# Altium schematic sheet Input_Section.SchDoc: Input_Section
size A2; Date: 2026-04-25; ApprovedBy: Anbi; CheckedBy: Anbi; Author: FunnyElecs; CompanyName: DongA; DrawnBy: Seokipo; Engineer: Seokipo; Revision: 1.0; SheetNumber: 3; SheetTotal: 6
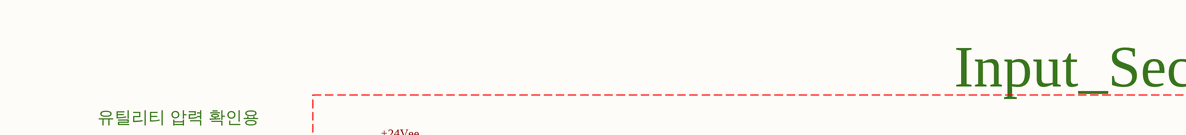
[diagram p0: Input_Section.SchDoc, top left]
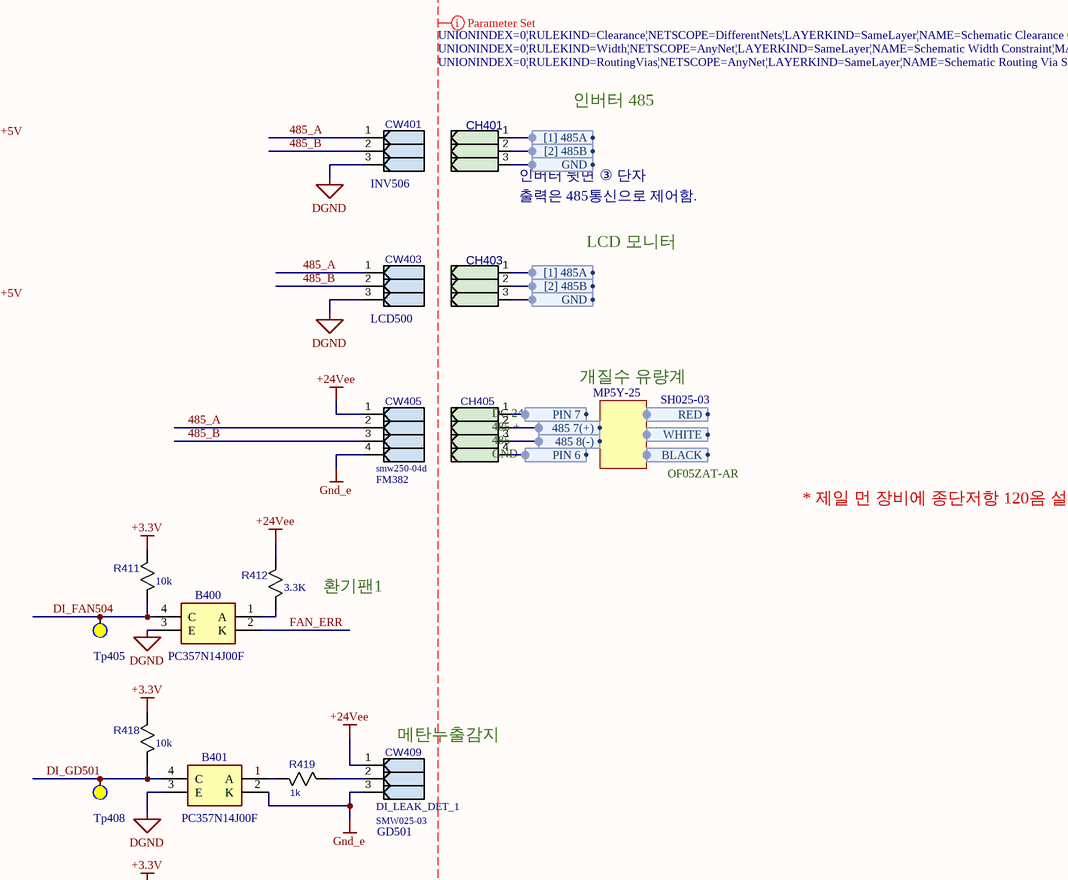
[diagram p1: Input_Section.SchDoc, top right]
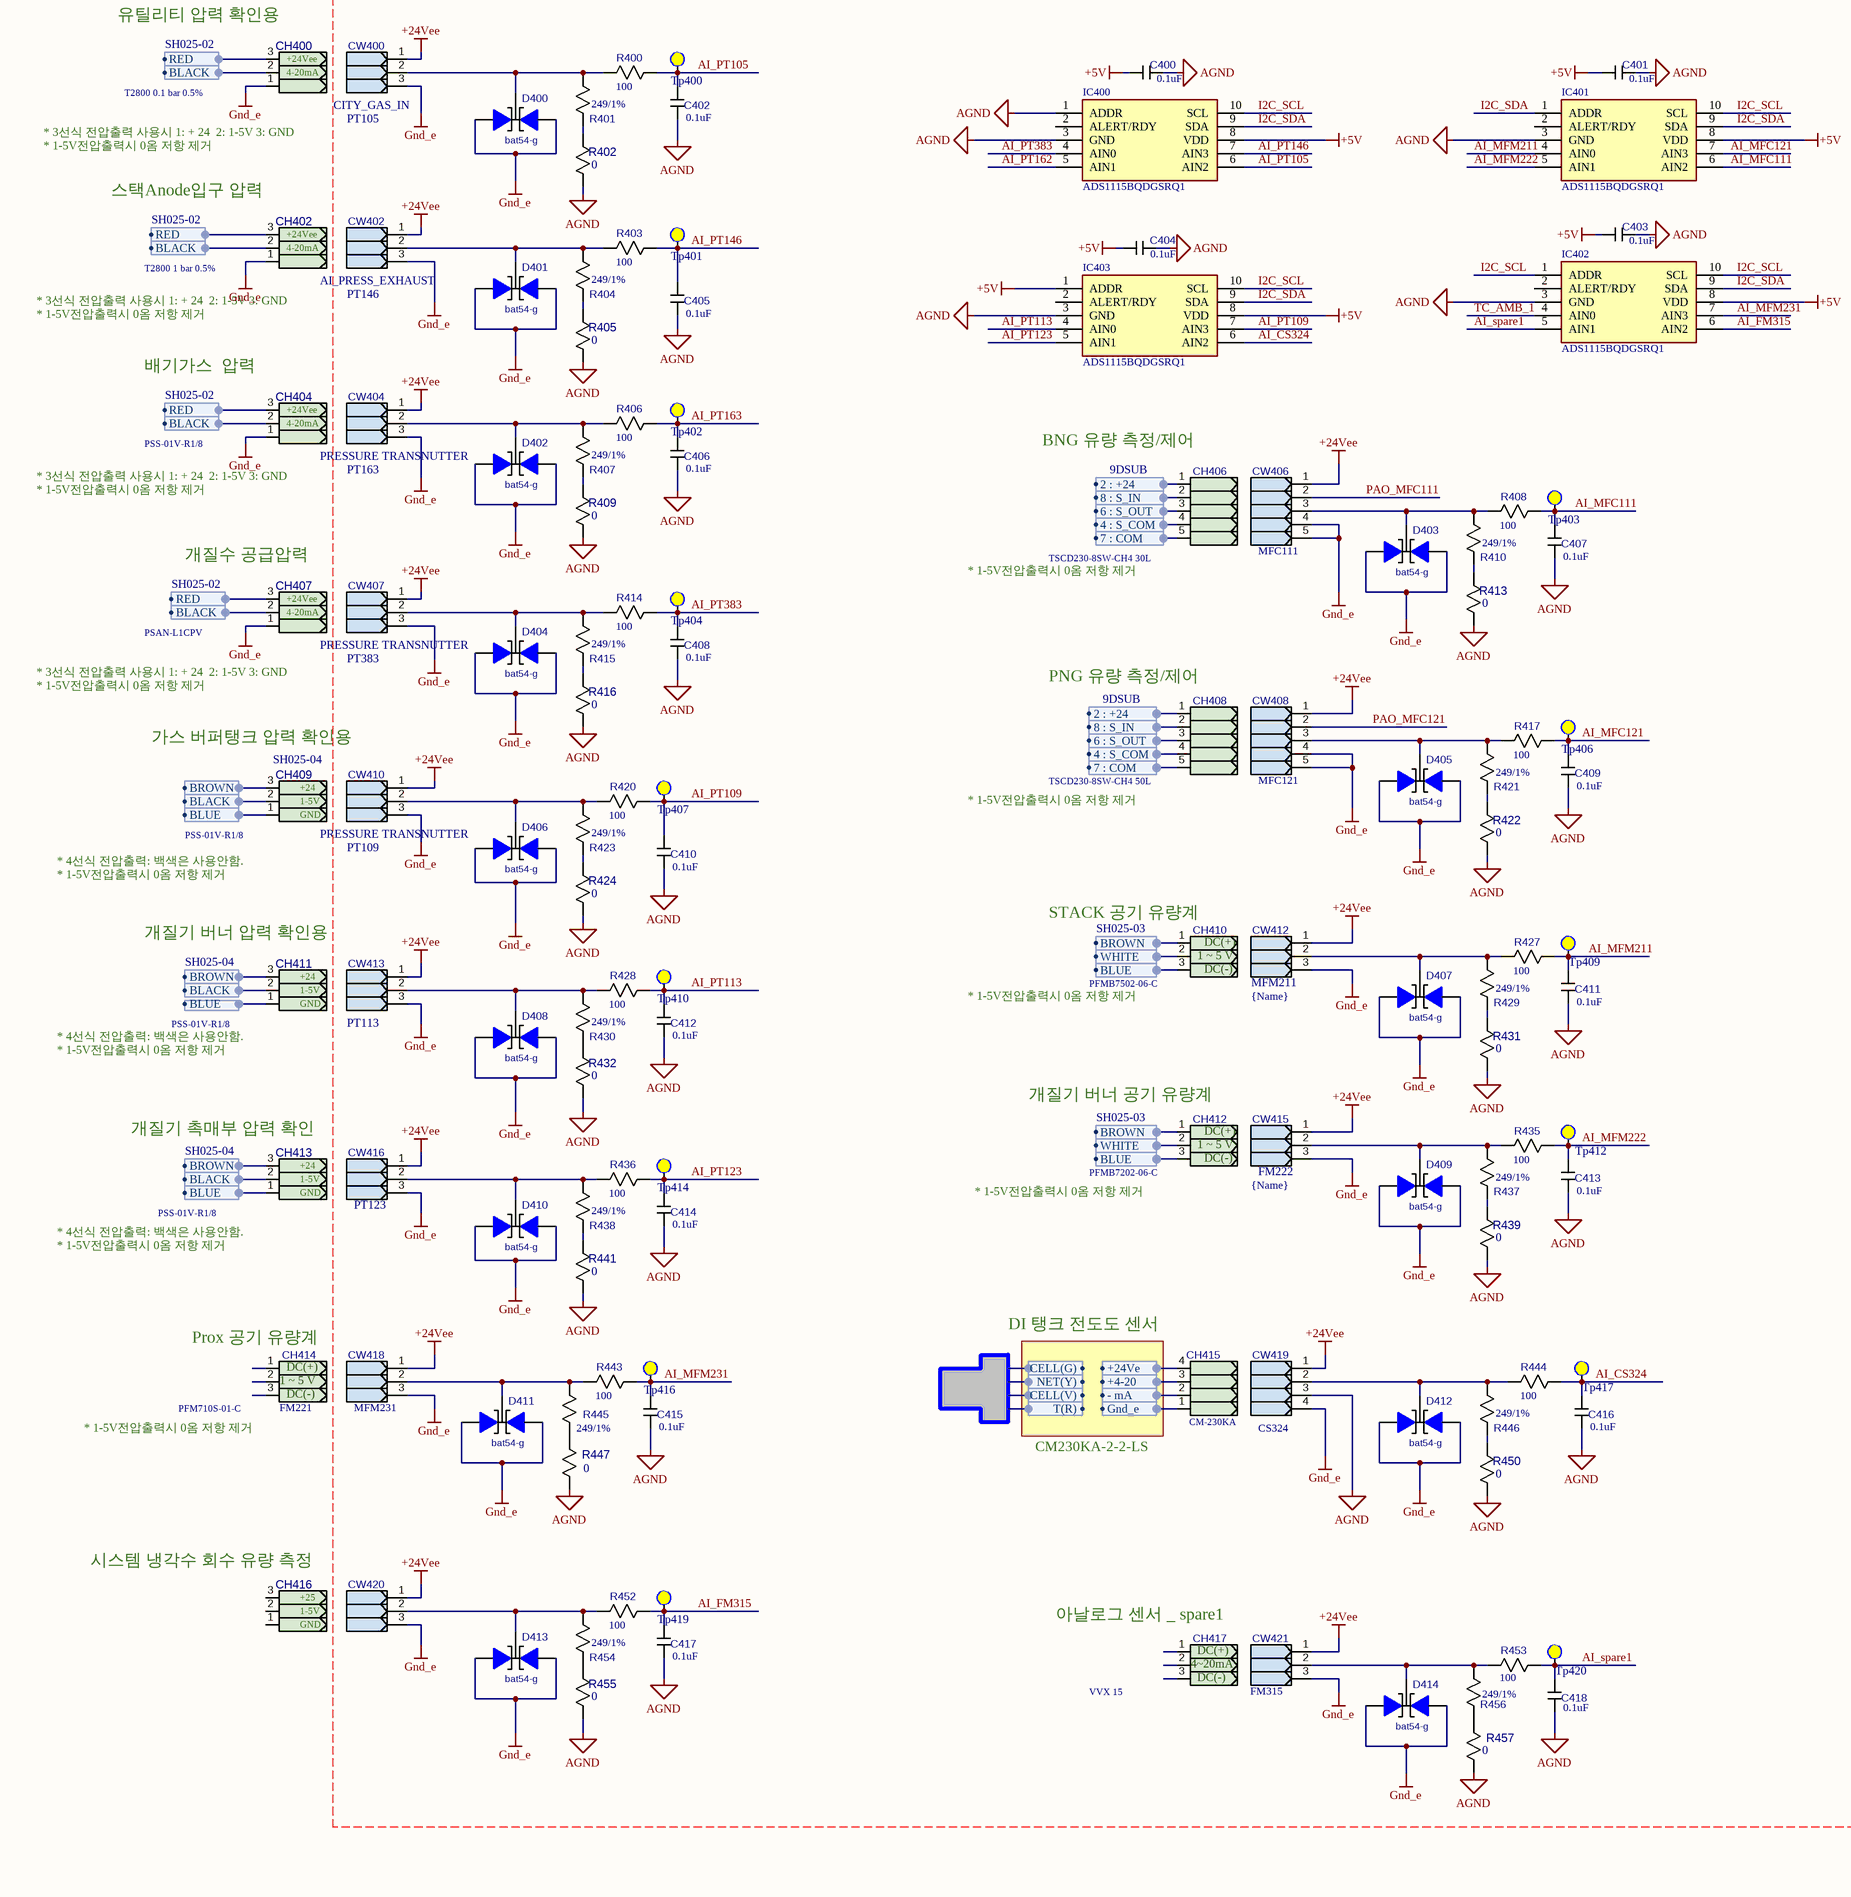
[diagram p2: Input_Section.SchDoc, bottom left]
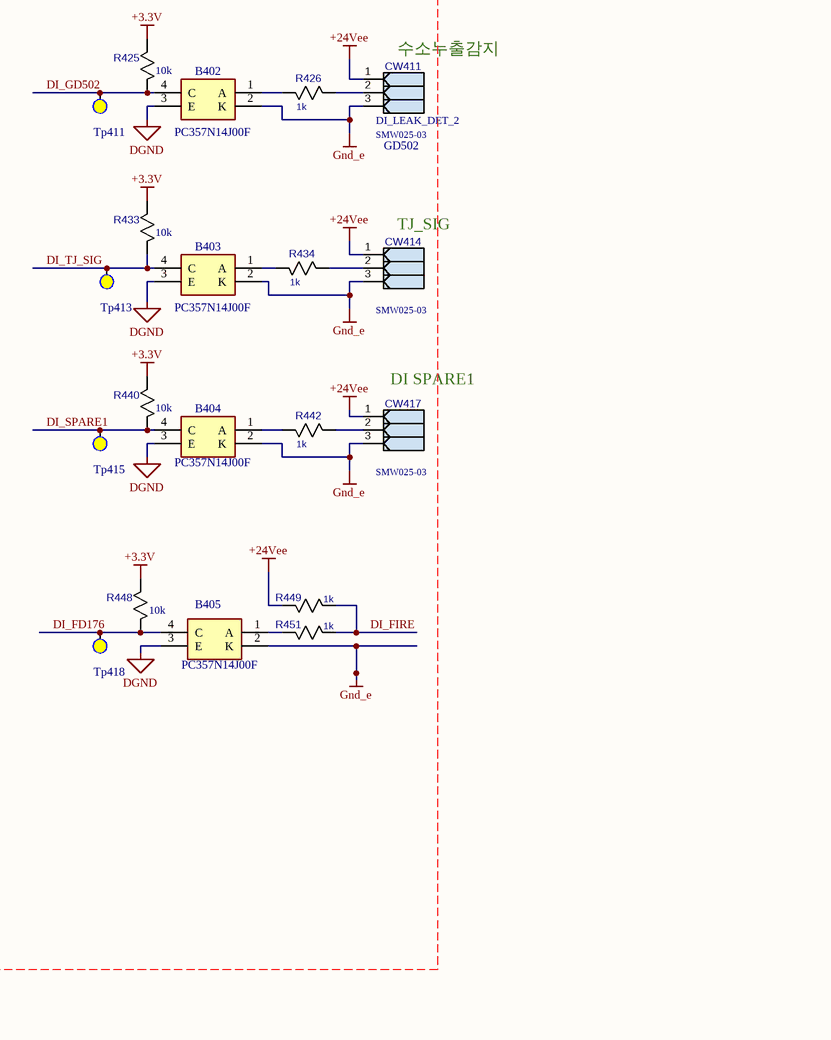
[diagram p3: Input_Section.SchDoc, bottom right]

## Parts
B400  PC357N14J00F  [SOP254P675X300-4N]
B401  PC357N14J00F  [SOP254P675X300-4N]
B402  PC357N14J00F  [SOP254P675X300-4N]
B403  PC357N14J00F  [SOP254P675X300-4N]
B404  PC357N14J00F  [SOP254P675X300-4N]
B405  PC357N14J00F  [SOP254P675X300-4N]
C400  규격: 0.1uF  [CC1608N]  (hidden comment: CS1608)
C401  규격: 0.1uF  [CC1608N]  (hidden comment: CS1608)
C402  규격: 0.1uF  [CC1608N]  (hidden comment: CS1608)
C403  규격: 0.1uF  [CC1608N]  (hidden comment: CS1608)
C404  규격: 0.1uF  [CC1608N]  (hidden comment: CS1608)
C405  규격: 0.1uF  [CC1608N]  (hidden comment: CS1608)
C406  규격: 0.1uF  [CC1608N]  (hidden comment: CS1608)
C407  규격: 0.1uF  [CC1608N]  (hidden comment: CS1608)
C408  규격: 0.1uF  [CC1608N]  (hidden comment: CS1608)
C409  규격: 0.1uF  [CC1608N]  (hidden comment: CS1608)
C410  규격: 0.1uF  [CC1608N]  (hidden comment: CS1608)
C411  규격: 0.1uF  [CC1608N]  (hidden comment: CS1608)
C412  규격: 0.1uF  [CC1608N]  (hidden comment: CS1608)
C413  규격: 0.1uF  [CC1608N]  (hidden comment: CS1608)
C414  규격: 0.1uF  [CC1608N]  (hidden comment: CS1608)
C415  규격: 0.1uF  [CC1608N]  (hidden comment: CS1608)
C416  규격: 0.1uF  [CC1608N]  (hidden comment: CS1608)
C417  규격: 0.1uF  [CC1608N]  (hidden comment: CS1608)
C418  규격: 0.1uF  [CC1608N]  (hidden comment: CS1608)
CH400  Part No.: T2800 0.1 bar 0.5%  (hidden comment: Connect Housing)
CH401  Connect Housing  (value not drawn)
CH402  Part No.: T2800 1 bar 0.5%  (hidden comment: Connect Housing)
CH403  Connect Housing  (value not drawn)
CH404  Part No.: PSS-01V-R1/8  (hidden comment: Connect Housing)
CH405  Connect Housing  (value not drawn)
CH406  Part No.: TSCD230-8SW-CH4 30L  (hidden comment: Connect Housing)
CH407  Part No.: PSAN-L1CPV  (hidden comment: Connect Housing)
CH408  Part No.: TSCD230-8SW-CH4 50L  (hidden comment: Connect Housing)
CH409  Part No.: PSS-01V-R1/8  (hidden comment: Connect Housing)
CH410  Part No.: PFMB7502-06-C  (hidden comment: Connect Housing)
CH411  Part No.: PSS-01V-R1/8  (hidden comment: Connect Housing)
CH412  Part No.: PFMB7202-06-C  (hidden comment: Connect Housing)
CH413  Part No.: PSS-01V-R1/8  (hidden comment: Connect Housing)
CH414  Part No.: PFM710S-01-C  BOP No: FM221  (hidden comment: Connect Housing)
CH415  Part No.: CM-230KA  (hidden comment: Connect Housing)
CH416  Connect Housing  (value not drawn)
CH417  Part No.: VVX 15  (hidden comment: Connect Housing)
CW400  Name: CITY_GAS_IN  BOP No: PT105  [SMW250-03D]  (hidden comment: SMW250-03D)
CW401  BOP No: INV506  [SMW250-03D]  (hidden comment: SMW250-03D)
CW402  Name: AI_PRESS_EXHAUST  BOP No: PT146  [SMW250-03D]  (hidden comment: SMW250-03D)
CW403  BOP No: LCD500  [SMW250-03D]  (hidden comment: SMW250-03D)
CW404  Name: PRESSURE TRANSNUTTER  BOP No: PT163  [SMW250-03D]  (hidden comment: SMW250-03D)
CW405  BOP No: FM382  [SMW250-04D]  (hidden comment: SMW250-04D)
CW406  BOP No: MFC111  [SMW250-05D]  (hidden comment: SMW250-05D)
CW407  Name: PRESSURE TRANSNUTTER  BOP No: PT383  [SMW250-03D]  (hidden comment: SMW250-03D)
CW408  BOP No: MFC121  [SMW250-05D]  (hidden comment: SMW250-05D)
CW409  Name: DI_LEAK_DET_1  Part No.: SMW025-03  BOP No: GD501  [SMW250-03D]  (hidden comment: SMW250-03D)
CW410  Name: PRESSURE TRANSNUTTER  BOP No: PT109  [SMW250-03D]  (hidden comment: SMW250-03D)
CW411  Name: DI_LEAK_DET_2  Part No.: SMW025-03  BOP No: GD502  [SMW250-03D]  (hidden comment: SMW250-03D)
CW412  Name: {Name}  BOP No: MFM211  [SMW250-03D]  (hidden comment: SMW250-03D)
CW413  BOP No: PT113  [SMW250-03D]  (hidden comment: SMW250-03D)
CW414  Part No.: SMW025-03  [SMW250-03D]  (hidden comment: SMW250-03D)
CW415  Name: {Name}  BOP No: FM222  [SMW250-03D]  (hidden comment: SMW250-03D)
CW416  BOP No: PT123  [SMW250-03D]  (hidden comment: SMW250-03D)
CW417  Part No.: SMW025-03  [SMW250-03D]  (hidden comment: SMW250-03D)
CW418  BOP No: MFM231  [SMW250-03D]  (hidden comment: SMW250-03D)
CW419  BOP No: CS324  [SMW250-04D]  (hidden comment: SMW250-04D)
CW420  SMW250-03D  [SMW250-03D]  (value not drawn)
CW421  BOP No: FM315  [SMW250-03D]  (hidden comment: SMW250-03D)
D400  Part No.: bat54-g  [SOT-23]  (hidden comment: BAT54C-G)
D401  Part No.: bat54-g  [SOT-23]  (hidden comment: BAT54C-G)
D402  Part No.: bat54-g  [SOT-23]  (hidden comment: BAT54C-G)
D403  Part No.: bat54-g  [SOT-23]  (hidden comment: BAT54C-G)
D404  Part No.: bat54-g  [SOT-23]  (hidden comment: BAT54C-G)
D405  Part No.: bat54-g  [SOT-23]  (hidden comment: BAT54C-G)
D406  Part No.: bat54-g  [SOT-23]  (hidden comment: BAT54C-G)
D407  Part No.: bat54-g  [SOT-23]  (hidden comment: BAT54C-G)
D408  Part No.: bat54-g  [SOT-23]  (hidden comment: BAT54C-G)
D409  Part No.: bat54-g  [SOT-23]  (hidden comment: BAT54C-G)
D410  Part No.: bat54-g  [SOT-23]  (hidden comment: BAT54C-G)
D411  Part No.: bat54-g  [SOT-23]  (hidden comment: BAT54C-G)
D412  Part No.: bat54-g  [SOT-23]  (hidden comment: BAT54C-G)
D413  Part No.: bat54-g  [SOT-23]  (hidden comment: BAT54C-G)
D414  Part No.: bat54-g  [SOT-23]  (hidden comment: BAT54C-G)
IC400  ADS1115BQDGSRQ1  [SOP50P490X110-10N]
IC401  ADS1115BQDGSRQ1  [SOP50P490X110-10N]
IC402  ADS1115BQDGSRQ1  [SOP50P490X110-10N]
IC403  ADS1115BQDGSRQ1  [SOP50P490X110-10N]
R400  규격: 100  [RESC1608X55N]  (hidden comment: R1608)
R401  규격: 249/1%  [RESC1608X55N]  (hidden comment: R1608)
R402  규격: 0  [R3216]  (hidden comment: R3216)
R403  규격: 100  [RESC1608X55N]  (hidden comment: R1608)
R404  규격: 249/1%  [RESC1608X55N]  (hidden comment: R1608)
R405  규격: 0  [R3216]  (hidden comment: R3216)
R406  규격: 100  [RESC1608X55N]  (hidden comment: R1608)
R407  규격: 249/1%  [RESC1608X55N]  (hidden comment: R1608)
R408  규격: 100  [RESC1608X55N]  (hidden comment: R1608)
R409  규격: 0  [R3216]  (hidden comment: R3216)
R410  규격: 249/1%  [RESC1608X55N]  (hidden comment: R1608)
R411  규격: 10k  [RESC1608X55N]  (hidden comment: R1608)
R412  규격: 3.3K  [RESC1608X55N]  (hidden comment: R1608)
R413  규격: 0  [R3216]  (hidden comment: R3216)
R414  규격: 100  [RESC1608X55N]  (hidden comment: R1608)
R415  규격: 249/1%  [RESC1608X55N]  (hidden comment: R1608)
R416  규격: 0  [R3216]  (hidden comment: R3216)
R417  규격: 100  [RESC1608X55N]  (hidden comment: R1608)
R418  규격: 10k  [RESC1608X55N]  (hidden comment: R1608)
R419  Part No.: 1k  [R2012]  (hidden comment: R2012)
R420  규격: 100  [RESC1608X55N]  (hidden comment: R1608)
R421  규격: 249/1%  [RESC1608X55N]  (hidden comment: R1608)
R422  규격: 0  [R3216]  (hidden comment: R3216)
R423  규격: 249/1%  [RESC1608X55N]  (hidden comment: R1608)
R424  규격: 0  [R3216]  (hidden comment: R3216)
R425  규격: 10k  [RESC1608X55N]  (hidden comment: R1608)
R426  Part No.: 1k  [R2012]  (hidden comment: R2012)
R427  규격: 100  [RESC1608X55N]  (hidden comment: R1608)
R428  규격: 100  [RESC1608X55N]  (hidden comment: R1608)
R429  규격: 249/1%  [RESC1608X55N]  (hidden comment: R1608)
R430  규격: 249/1%  [RESC1608X55N]  (hidden comment: R1608)
R431  규격: 0  [R3216]  (hidden comment: R3216)
R432  규격: 0  [R3216]  (hidden comment: R3216)
R433  규격: 10k  [RESC1608X55N]  (hidden comment: R1608)
R434  Part No.: 1k  [R2012]  (hidden comment: R2012)
R435  규격: 100  [RESC1608X55N]  (hidden comment: R1608)
R436  규격: 100  [RESC1608X55N]  (hidden comment: R1608)
R437  규격: 249/1%  [RESC1608X55N]  (hidden comment: R1608)
R438  규격: 249/1%  [RESC1608X55N]  (hidden comment: R1608)
R439  규격: 0  [R3216]  (hidden comment: R3216)
R440  규격: 10k  [RESC1608X55N]  (hidden comment: R1608)
R441  규격: 0  [R3216]  (hidden comment: R3216)
R442  Part No.: 1k  [R2012]  (hidden comment: R2012)
R443  규격: 100  [RESC1608X55N]  (hidden comment: R1608)
R444  규격: 100  [RESC1608X55N]  (hidden comment: R1608)
R445  규격: 249/1%  [RESC1608X55N]  (hidden comment: R1608)
R446  규격: 249/1%  [RESC1608X55N]  (hidden comment: R1608)
R447  규격: 0  [R3216]  (hidden comment: R3216)
R448  규격: 10k  [RESC1608X55N]  (hidden comment: R1608)
R449  Part No.: 1k  [R2012]  (hidden comment: R2012)
R450  규격: 0  [R3216]  (hidden comment: R3216)
R451  Part No.: 1k  [R2012]  (hidden comment: R2012)
R452  규격: 100  [RESC1608X55N]  (hidden comment: R1608)
R453  규격: 100  [RESC1608X55N]  (hidden comment: R1608)
R454  규격: 249/1%  [RESC1608X55N]  (hidden comment: R1608)
R455  규격: 0  [R3216]  (hidden comment: R3216)
R456  규격: 249/1%  [RESC1608X55N]  (hidden comment: R1608)
R457  규격: 0  [R3216]  (hidden comment: R3216)
Tp400  Test Point_top  [TP_KEYSTONE_5000]  (value not drawn)
Tp401  Test Point_top  [TP_KEYSTONE_5000]  (value not drawn)
Tp402  Test Point_top  [TP_KEYSTONE_5000]  (value not drawn)
Tp403  Test Point_top  [TP_KEYSTONE_5000]  (value not drawn)
Tp404  Test Point_top  [TP_KEYSTONE_5000]  (value not drawn)
Tp405  Test Point_top  [TP_KEYSTONE_5000]  (value not drawn)
Tp406  Test Point_top  [TP_KEYSTONE_5000]  (value not drawn)
Tp407  Test Point_top  [TP_KEYSTONE_5000]  (value not drawn)
Tp408  Test Point_top  [TP_KEYSTONE_5000]  (value not drawn)
Tp409  Test Point_top  [TP_KEYSTONE_5000]  (value not drawn)
Tp410  Test Point_top  [TP_KEYSTONE_5000]  (value not drawn)
Tp411  Test Point_top  [TP_KEYSTONE_5000]  (value not drawn)
Tp412  Test Point_top  [TP_KEYSTONE_5000]  (value not drawn)
Tp413  Test Point_top  [TP_KEYSTONE_5000]  (value not drawn)
Tp414  Test Point_top  [TP_KEYSTONE_5000]  (value not drawn)
Tp415  Test Point_top  [TP_KEYSTONE_5000]  (value not drawn)
Tp416  Test Point_top  [TP_KEYSTONE_5000]  (value not drawn)
Tp417  Test Point_top  [TP_KEYSTONE_5000]  (value not drawn)
Tp418  Test Point_top  [TP_KEYSTONE_5000]  (value not drawn)
Tp419  Test Point_top  [TP_KEYSTONE_5000]  (value not drawn)
Tp420  Test Point_top  [TP_KEYSTONE_5000]  (value not drawn)

## Harnesses
9DSUB: 2 : +24
*: 4 : S_COM
*: 6 : S_OUT
*: 8 : S_IN
*: 7 : COM
SH025-02: RED
?: BLACK
SH025-04: BROWN
?: BLUE
SH025-03: BROWN
?: WHITE
SH025-02: +4-20
?: - mA
SH025-03: RED
MP5Y-25: PIN 7
?: 485 7(+)
?: 485 8(-)
?: PIN 6
?: [1] 485A
?: [2] 485B
SH025-02: +24Ve
SH025-02: Gnd_e
SH025-02: NET(Y)
?: CELL(V)
SH025-02: CELL(G)
SH025-02: T(R)
?: GND

## Nets
+3.3V: R411.2 R418.2 R425.2 R433.2 R440.2 R448.2
+5V: C400.1 C401.1 C403.1 C404.1 IC400.8(VDD) IC401.8(VDD) IC402.8(VDD) IC403.1(ADDR) IC403.8(VDD)
+24Vee: CW400.1 CW402.1 CW404.1 CW405.1 CW406.1 CW407.1 CW408.1 CW409.1 CW410.1 CW411.1 CW412.1 CW413.1 CW414.1 CW415.1 CW416.1 CW417.1 CW418.1 CW419.1 CW420.1 CW421.1 R412.2 R449.2
AGND: C400.2 C401.2 C402.2 C403.2 C404.2 C405.2 C406.2 C407.2 C408.2 C409.2 C410.2 C411.2 C412.2 C413.2 C414.2 C415.2 C416.2 C417.2 C418.2 CW419.3 IC400.1(ADDR) IC400.3(GND) IC401.3(GND) IC402.3(GND) IC403.3(GND) R402.1 R405.1 R409.1 R413.1 R416.1 R422.1 R424.1 R431.1 R432.1 R439.1 R441.1 R447.1 R450.1 R455.1 R457.1
DGND: B400.3(E) B401.3(E) B402.3(E) B403.3(E) B404.3(E) B405.3(E) CW401.3 CW403.3
Gnd_e: B401.2(K) B402.2(K) B403.2(K) B404.2(K) B405.2(K) CH400.1 CH402.1 CH404.1 CH407.1 CW400.3 CW402.3 CW404.3 CW405.4 CW406.4 CW406.5 CW407.3 CW408.4 CW408.5 CW409.3 CW410.3 CW411.3 CW412.3 CW413.3 CW414.3 CW415.3 CW416.3 CW417.3 CW418.3 CW419.4 CW420.3 CW421.3 D400.1 D400.2 D401.1 D401.2 D402.1 D402.2 D403.1 D403.2 D404.1 D404.2 D405.1 D405.2 D406.1 D406.2 D407.1 D407.2 D408.1 D408.2 D409.1 D409.2 D410.1 D410.2 D411.1 D411.2 D412.1 D412.2 D413.1 D413.2 D414.1 D414.2
485_A: CW401.1 CW403.1 CW405.2
485_B: CW401.2 CW403.2 CW405.3
AI_CS324: C416.1 IC403.6(AIN2) R444.2 Tp417.1(tp)
AI_FM315: C417.1 IC402.6(AIN2) R452.2 Tp419.1(tp)
AI_MFC111: C407.1 IC401.6(AIN2) R408.2 Tp403.1(tp)
AI_MFC121: C409.1 IC401.7(AIN3) R417.2 Tp406.1(tp)
AI_MFM211: C411.1 IC401.4(AIN0) R427.2 Tp409.1(tp)
AI_MFM222: C413.1 IC401.5(AIN1) R435.2 Tp412.1(tp)
AI_MFM231: C415.1 IC402.7(AIN3) R443.2 Tp416.1(tp)
AI_PT105: C402.1 IC400.6(AIN2) R400.2 Tp400.1(tp)
AI_PT109: C410.1 IC403.7(AIN3) R420.2 Tp407.1(tp)
AI_PT113: C412.1 IC403.4(AIN0) R428.2 Tp410.1(tp)
AI_PT123: C414.1 IC403.5(AIN1) R436.2 Tp414.1(tp)
AI_PT146: C405.1 IC400.7(AIN3) R403.2 Tp401.1(tp)
AI_PT162: IC400.5(AIN1)
AI_PT163: C406.1 R406.2 Tp402.1(tp)
AI_PT383: C408.1 IC400.4(AIN0) R414.2 Tp404.1(tp)
AI_spare1: C418.1 IC402.5(AIN1) R453.2 Tp420.1(tp)
DI_FAN504: B400.4(C) R411.1 Tp405.1(tp)
DI_FD176: B405.4(C) R448.1 Tp418.1(tp)
DI_FIRE: R449.1 R451.1
DI_GD501: B401.4(C) R418.1 Tp408.1(tp)
DI_GD502: B402.4(C) R425.1 Tp411.1(tp)
DI_SPARE1: B404.4(C) R440.1 Tp415.1(tp)
DI_TJ_SIG: B403.4(C) R433.1 Tp413.1(tp)
FAN_ERR: B400.2(K)
I2C_SCL: IC400.10(SCL) IC401.10(SCL) IC402.1(ADDR) IC402.10(SCL) IC403.10(SCL)
I2C_SDA: IC400.9(SDA) IC401.1(ADDR) IC401.9(SDA) IC402.9(SDA) IC403.9(SDA)
PAO_MFC111: CW406.2
PAO_MFC121: CW408.2
TC_AMB_1: IC402.4(AIN0)
NetB400_1: B400.1(A) R412.1
NetB401_1: B401.1(A) R419.2
NetB402_1: B402.1(A) R426.2
NetB403_1: B403.1(A) R434.2
NetB404_1: B404.1(A) R442.2
NetB405_1: B405.1(A) R451.2
NetCW400_2: CW400.2 D400.3 R400.1 R401.2
NetCW402_2: CW402.2 D401.3 R403.1 R404.2
NetCW404_2: CW404.2 D402.3 R406.1 R407.2
NetCW406_3: CW406.3 D403.3 R408.1 R410.2
NetCW407_2: CW407.2 D404.3 R414.1 R415.2
NetCW408_3: CW408.3 D405.3 R417.1 R421.2
NetCW409_2: CW409.2 R419.1
NetCW410_2: CW410.2 D406.3 R420.1 R423.2
NetCW411_2: CW411.2 R426.1
NetCW412_2: CW412.2 D407.3 R427.1 R429.2
NetCW413_2: CW413.2 D408.3 R428.1 R430.2
NetCW414_2: CW414.2 R434.1
NetCW415_2: CW415.2 D409.3 R435.1 R437.2
NetCW416_2: CW416.2 D410.3 R436.1 R438.2
NetCW417_2: CW417.2 R442.1
NetCW418_2: CW418.2 D411.3 R443.1 R445.2
NetCW419_2: CW419.2 D412.3 R444.1 R446.2
NetCW420_2: CW420.2 D413.3 R452.1 R454.2
NetCW421_2: CW421.2 D414.3 R453.1 R456.2
NetR401_1: R401.1 R402.2
NetR404_1: R404.1 R405.2
NetR407_1: R407.1 R409.2
NetR410_1: R410.1 R413.2
NetR415_1: R415.1 R416.2
NetR421_1: R421.1 R422.2
NetR423_1: R423.1 R424.2
NetR429_1: R429.1 R431.2
NetR430_1: R430.1 R432.2
NetR437_1: R437.1 R439.2
NetR438_1: R438.1 R441.2
NetR445_1: R445.1 R447.2
NetR446_1: R446.1 R450.2
NetR454_1: R454.1 R455.2
NetR456_1: R456.1 R457.2

Not connected (* = marked no-connect by the designer): CH400 2 3; CH401 1 2 3; CH402 2 3; CH403 1 2 3; CH404 2 3; CH405 1 2 3 4; CH406 1 2 3 4 5; CH407 2 3; CH408 1 2 3 4 5; CH409 1 2 3; CH410 1 2 3; CH411 1 2 3; CH412 1 2 3; CH413 1 2 3; CH414 1 2 3; CH415 1 2 3 4; CH416 1 2 3; CH417 1 2 3; IC400 2(ALERT/RDY); IC401 2(ALERT/RDY); IC402 2(ALERT/RDY); IC403 2(ALERT/RDY)

## Layout directives
rule Clearance Constraint [Clearance = 0.2mm]; rule Width Constraint [Pref Width = 0.5mm    Min Width = 0.2mm    Max Width = 1mm]; rule Routing Via Style [Pref Size = 0.5mm    Pref Hole Size = 0.3mm]: 485_A, 485_B, +3.3V, +5V, +24Vee, AGND, AI_CS324, AI_FM315, AI_MFC111, AI_MFC121, AI_MFM211, AI_MFM222, AI_MFM231, AI_PT105, AI_PT109, AI_PT113, AI_PT123, AI_PT146, AI_PT162, AI_PT163, AI_PT383, AI_spare1, DGND, DI_FAN504, DI_FD176, DI_FIRE, DI_GD501, DI_GD502, DI_SPARE1, DI_TJ_SIG, FAN_ERR, Gnd_e, I2C_SCL, I2C_SDA, PAO_MFC111, PAO_MFC121, TC_AMB_1

## Notes on the sheet
- 유틸리티 압력 확인용
- Input_Section.SchDoc
- (near CH400) +24Vee
- (near CH400) 4-20mA
- (near CH400) 4-20
- (near CH400) -
- (near CH400) * 3선식 전압출력 사용시 1: + 24  2: 1-5V 3: GND
- * 1-5V전압출력시 0옴 저항 제거
- (near CH401) 인버터 485
- 스택Anode입구 압력
- (near CH402) +24Vee
- (near CH401) 인버터 뒷면 ③ 단자
- (near CH401) 출력은 485통신으로 제어함.
- (near CH402) 4-20mA
- (near CH403) LCD 모니터
- (near CH402) * 3선식 전압출력 사용시 1: + 24  2: 1-5V 3: GND
- 배기가스  압력
- (near CH404) 4-20mA
- (near CH404) +24Vee
- (near CH405) DC 24
- (near CH405) 개질수 유량계
- DC 12  5
- (near CH404) * 3선식 전압출력 사용시 1: + 24  2: 1-5V 3: GND
- BNG 유량 측정/제어
- (near CH405) 485 +
- (near CH405) 485 -
- (near CH405) GND
- cnt,1 or 2
- DC 0    4
- OF05ZAT-AR
- (near CH407) 개질수 공급압력
- * 제일 먼 장비에 종단저항 120옴 설치할것
- (near CH407) +24Vee
- (near CH407) 4-20mA
- (near R412) 환기팬1
- (near CH407) * 3선식 전압출력 사용시 1: + 24  2: 1-5V 3: GND
- (near CH408) PNG 유량 측정/제어
- (near CH409) 가스 버퍼탱크 압력 확인용
- (near CW409) 메탄누출감지
- (near CH409) 1-5V
- (near CH409) GND
- (near CH409) +24
- * 4선식 전압출력: 백색은 사용안함.
- (near CW411) 수소누출감지
- (near CH411) 개질기 버너 압력 확인용
- (near CH410) STACK 공기 유량계
- (near CH410) 1 ~ 5 V
- (near CH410) DC(+)
- (near CH410) DC(-)
- (near CH411) +24
- (near CH411) GND
- (near CH411) 1-5V
- 개질기 버너 공기 유량계
- (near CW414) TJ_SIG
- (near CH413) 개질기 촉매부 압력 확인
- (near CH413) +24
- (near CH413) 1-5V
- (near CH412) 1 ~ 5 V
- (near CH412) DC(+)
- (near CH412) DC(-)
- (near CH413) GND
- (near CW417) DI SPARE1
- (near CH414) Prox 공기 유량계
- (near CH414) DC(+)
- DI 탱크 전도도 센서
- (near CH414) 1 ~ 5 V
- (near CH414) DC(-)
- CM230KA-2-2-LS
- 시스템 냉각수 회수 유량 측정
- (near CH416) +25
- (near CH416) GND
- (near CH416) 1-5V
- (near CH417) 아날로그 센서 _ spare1
- (near CH417) 4~20mA
- (near CH417) DC(+)
- (near CH417) DC(-)

## Library data of the parts
B400-B405 = PC357N14J00F: Integrated Circuit; Part No.: PC357N14J00F; Height: 3mm; Price: 81
C400-C418 = CS1608: Part No.: {Part No}; Price: 6
CH400 CH402 = CH_03: 시티가스 공급압력 확인; Price: {Price}
CH401 CH403 = CH_03: Price: {Price}
CH404 = CH_03: 배기가스 출구 압력 측정 / O T2800 1 bar 0.5%; Price: {Price}
CH405 = CH_04: 개질수 유량계 / 사용부품 : OF05ZAT-AR; Price: {Price}
CH406 CH408 = CH_05: AI_PNG MFC / TSCD230-6SW-CH4 30L; Price: {Price}
CH407 = CH_03: 개질수 압력 / O T2800 10 bar 0.5% / O 4~20mA / O T2800 1 bar 0.5%; Price: {Price}
CH409 = CH_03: 가압 버퍼탱크 압력 측정 / 사용부품 : PSS-01A-R1/8 / O T2800 1 bar 0.5%; Price: {Price}
CH410 CH412 = CH_03: 스택 공기 유량계 / O PFMB7501-04-D / O 1 ~ 5 V 입력 / 4~20mA; Price: {Price}
CH411 CH416 = CH_03: 개질기 버너 압력 확인용 / 사용부품 : PSS-01V-R1/8 / O T2800 1 bar 0.5%; Price: {Price}
CH413 = CH_03: 개질기 촉매부 압력 확인 / 사용부품 : PSS-01V-R1/8 / O T2800 1 bar 0.5%; Price: {Price}
CH414 CH417 = CH_03: Prox 공기 유량계 / O PFMB7501-04-D / O 1 ~ 5 V 출력; Price: {Price}
CH415 = CH_04: [DI 탱크 전도도 센서] / O 4~20mA Input; Price: {Price}
CW400 = SMW250-03D: {도시가스 입압} / 사용부품 : T2800 0.1 bar 0.5% / 시티가스 공급압력 확인; Part No.: SMW025-03; Price: 31.2
CW401 CW403 CW412 CW415 = SMW250-03D: Part No.: SMW025-03; Price: 31.2
CW402 CW404 = SMW250-03D: 개질가스(스택입구) 압력 / 사용부품 : T2800 1 bar 0.5%; Part No.: SMW025-03; Price: 31.2
CW405 = SMW250-04D: 485통신; Name: {Name}; Price: 57.5; Part No.: smw250-04d
CW406 CW408 = SMW250-05D: AI_PNG MFC / TSCD230-6SW-CH4 30L; Part No.: smw025-05; Price: 67.2; Name: AI_PNG MFC
CW407 = SMW250-03D: 개질기 촉매부 압력 확인 / O 사용부품 : T2800 1 bar 0.5% / O 4~20mA Input; Part No.: SMW025-03; Price: 31.2
CW409 = SMW250-03D: GD504 / (메탄가스누출감지기): 가스가 샜을 때 경보(0 또는 1)만 던져주는 순수 상태 감시용 디지털 입력단이야. 고속 처리가 필요 없는 일반 GPIO 특성.; Price: 31.2
CW410 = SMW250-03D: 가압 버퍼탱크 압력 측정 / 사용부품 : PSS-01V-R1/8; Part No.: SMW025-03; Price: 31.2
CW411 CW417 = SMW250-03D: GD505 (수소 가스누출감지기): 가스가 샜을 때 경보(0 또는 1)만 던져주는 순수 상태 감시용 디지털 입력단이야. 고속 처리가 필요 없는 일반 GPIO 특성.; Price: 31.2
CW413 CW420 = SMW250-03D: 개질기 버너 압력 확인용 / 사용부품 : PSS-01V-R1/8; Part No.: SMW025-03; Name: AI_PT124; Price: 31.2
CW416 = SMW250-03D: 개질기 촉매부 압력 확인 / 사용부품 : PSS-01V-R1/8; Part No.: SMW025-03; Name: AI_PT124; Price: 31.2
CW418 CW421 = SMW250-03D: Part No.: SMW025-03; Name: {Name}; Price: 31.2
CW419 = SMW250-04D: [DI 탱크 전도도 센서] / O 4~20mA Input[DI 탱크 전도도 센서]; Name: AI_CS324; Price: 57.5; Part No.: smw250-04d
IC400-IC403 = ADS1115BQDGSRQ1: Integrated Circuit; Height: 1.1mm; Part No.: ADS1115BQDGSRQ1; Price: 4490
R400 R403 R406 R408 R414 R417 R420 R427 R428 R435 R436 R443 R444 R452 R453 = R1608: Part No.: WR06X101JT(100R)J; Price: 1.0
R401 R404 R407 R410 R415 R421 R423 R429 R430 R437 R438 R445 R446 R454 R456 = R1608: Part No.: WR06X2490FT(249R)F; Price: 1.0
R402 R405 R409 R413 R416 R422 R424 R431 R432 R439 R441 R447 R450 R455 R457 = R3216: Part No.: WR12X000PT(0R)J; Price: 2.1
R411 R418 R425 R433 R440 R448 = R1608: Part No.: WR06X103JT(10KR)J; Price: 1.0
R412 = R1608: Part No.: WR06X332JT(3.3KR)J; Price: 1.0
R419 R426 R434 R442 R449 R451 = R2012: 규격: {Value}; Price: 2
Tp400-Tp404 Tp406-Tp420 = Tp_5000: Pad30; Part No.: *
Tp405 = Tp_5000: Pad30; NetName: DI_FAN504; Part No.: *
CW414 = SMW250-03D: Price: 31.2
D400-D414 = BAT54C-G: Price: 35